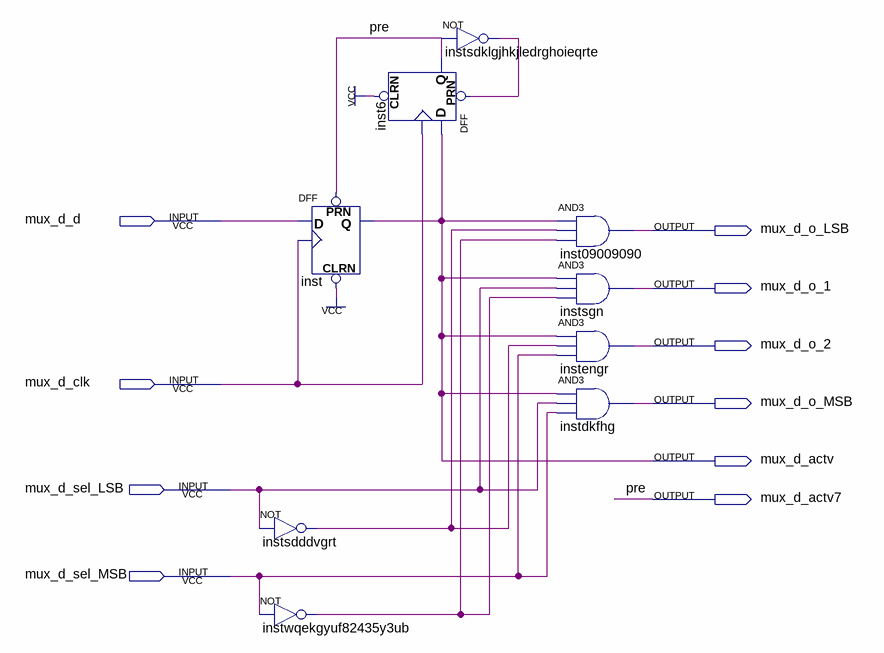
[diagram p0: schematic sheet]
// Quartus schematic loader.bdf as structural Verilog: 9 symbols, 10 pins
module loader (
  input  mux_d_d,
  input  mux_d_clk,
  input  mux_d_sel_LSB,
  input  mux_d_sel_MSB,
  output mux_d_o_LSB,
  output mux_d_o_1,
  output mux_d_o_2,
  output mux_d_o_MSB,
  output mux_d_actv,
  output mux_d_actv7
);

  wire instsdddvgrt_out, instsdklgjhkjledrghoieqrte_out, instwqekgyuf82435y3ub_out;

  not instsdddvgrt (instsdddvgrt_out, mux_d_sel_LSB);
  not instwqekgyuf82435y3ub (instwqekgyuf82435y3ub_out, mux_d_sel_MSB);
  DFF inst (.CLRN(1'b1), .CLK(mux_d_clk), .D(mux_d_d), .PRN(mux_d_actv7), .Q(mux_d_actv));
  DFF inst6 (.CLRN(1'b1), .CLK(mux_d_clk), .D(mux_d_actv), .PRN(instsdklgjhkjledrghoieqrte_out), .Q(mux_d_actv7));
  not instsdklgjhkjledrghoieqrte (instsdklgjhkjledrghoieqrte_out, mux_d_actv7);
  and inst09009090 (mux_d_o_LSB, mux_d_actv, instsdddvgrt_out, instwqekgyuf82435y3ub_out);
  and instsgn (mux_d_o_1, mux_d_actv, mux_d_sel_LSB, instwqekgyuf82435y3ub_out);
  and instengr (mux_d_o_2, mux_d_actv, instsdddvgrt_out, mux_d_sel_MSB);
  and instdkfhg (mux_d_o_MSB, mux_d_actv, mux_d_sel_LSB, mux_d_sel_MSB);

  // Other names for the same wires on the sheet: pre = mux_d_actv7
endmodule
